# EAGLE board BusPirate-ultra.v1.0c (EAGLE 9.1.3), part 1 of 2
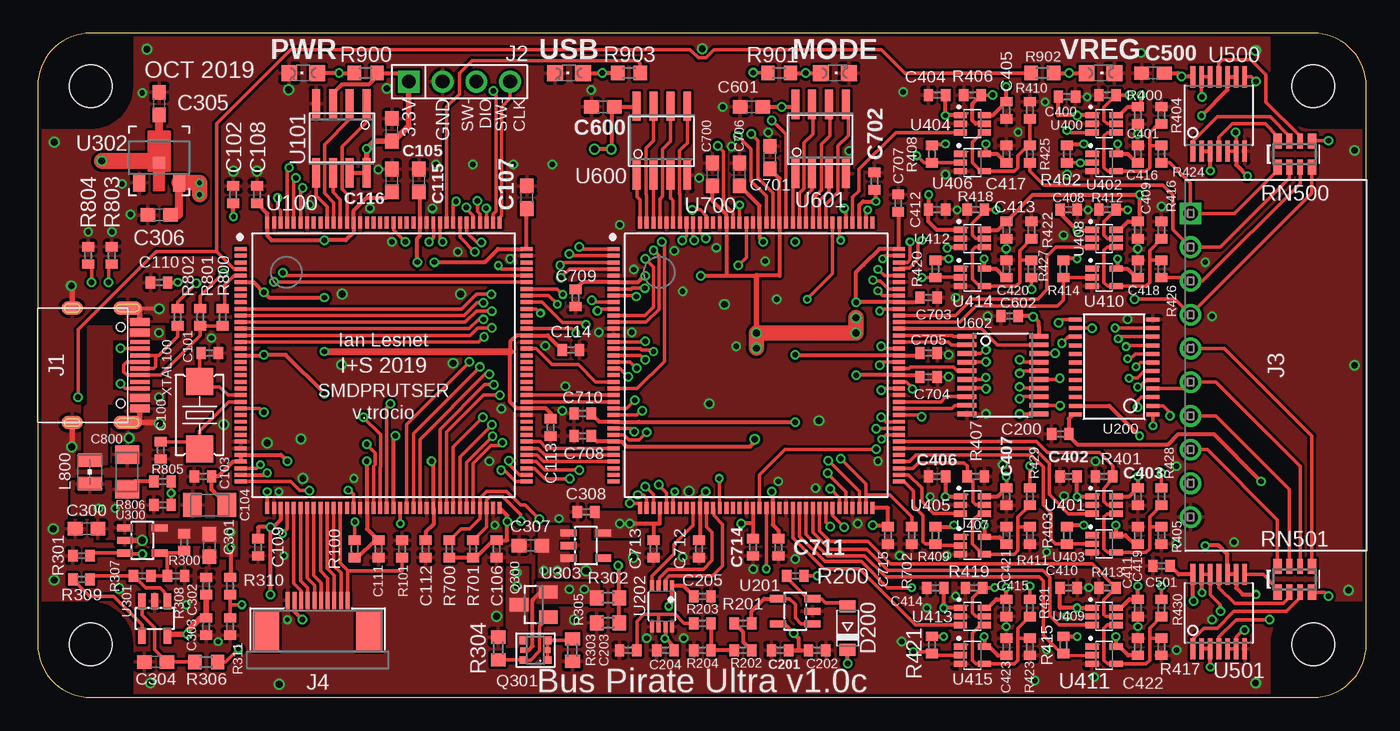
[diagram p3: board, top side]
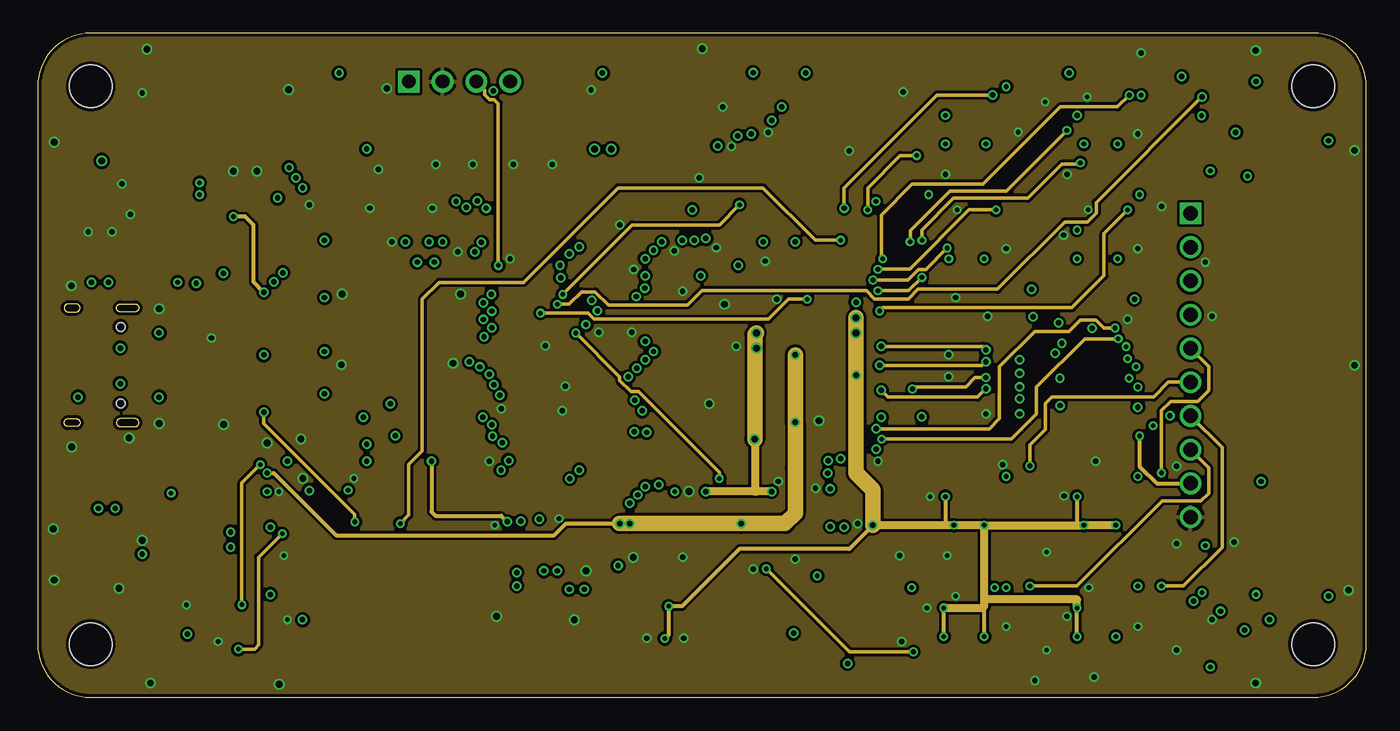
[diagram p4: board, inner layer Route2]
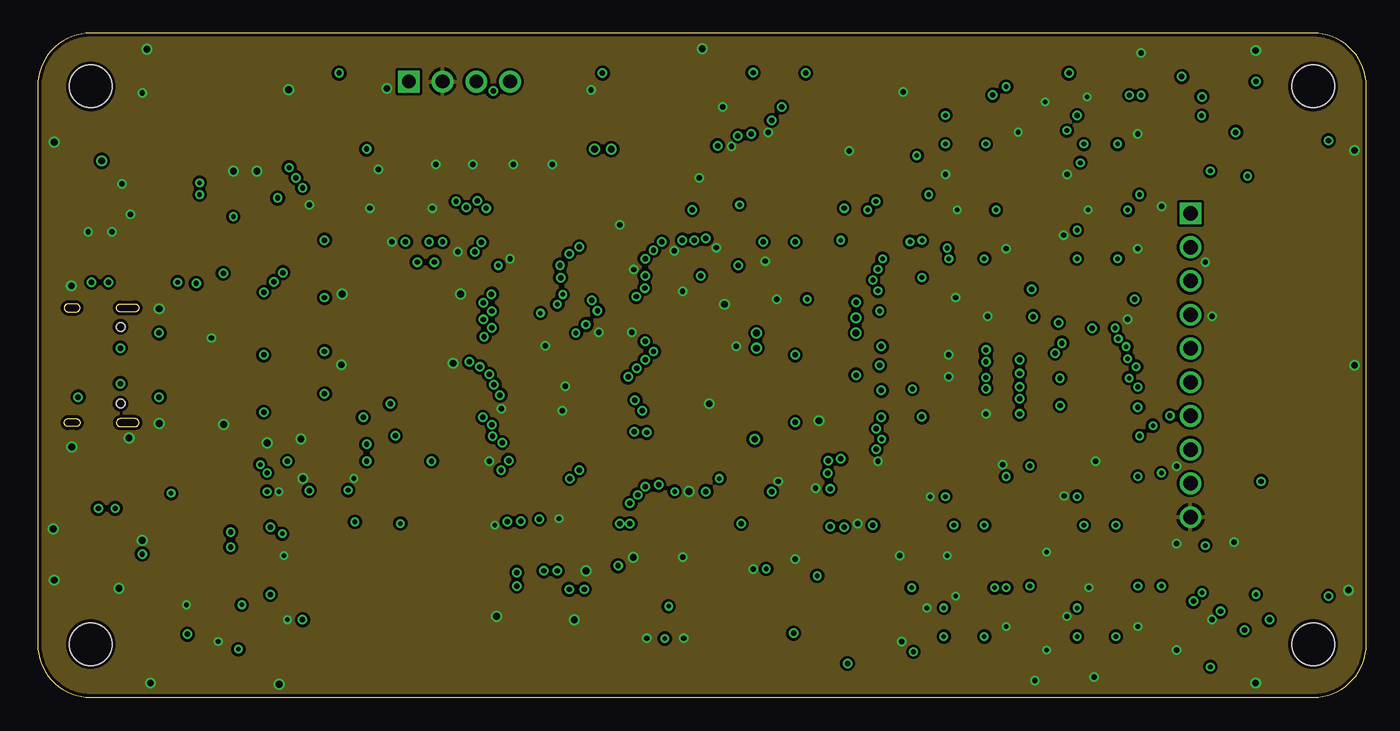
[diagram p5: board, inner layer Route15]
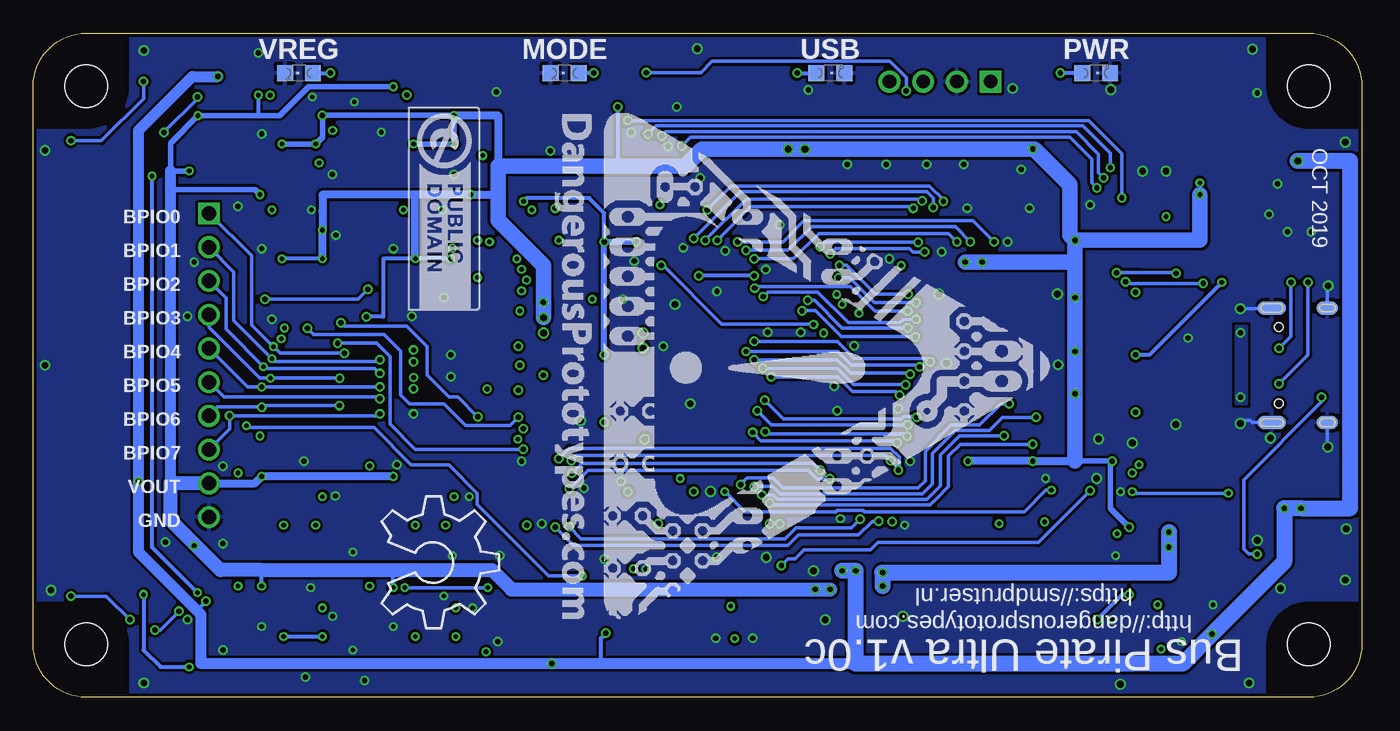
[diagram p6: board, bottom side, seen from below]

Size 100 x 50 mm. Coordinates in mm from the lower left corner, seen from the top.
Copper layers (1+2*15+16): Top 0.035mm / dielectric 1.5mm / Route2 0.0175mm / dielectric 1.1mm / Route15 0.0175mm / dielectric 0.2mm / Bottom 0.035mm
Design rules "dirt_cheap_dirty_boards.v1.1 *": minimum track width 6mil, minimum drill 12mil, track to track 6mil, track to pad 6mil, pad to pad 6mil, via to via 6mil, smd to smd 0mil, copper to edge 10mil, drill to drill 10mil, minimum pad ring 10mil, minimum via ring 6mil, stop-mask expansion 2mil, vias tented up to drill 25mil, thermal gap 10mil
Net classes: 1 power: width 0.305 mm; 2 signal_analog: width 0.254 mm; 3 signal_digital: width 0.254 mm; 4 signal_mixed: width 0.254 mm

## Footprints (pad centres in the part's own frame; a part is rotated, then mirrored left to right if it is on the bottom)
C402 = smd 0.7 x 0.9: 1 -0.65,0; 2 0.65,0
SMC_A = smd 1.4 x 1.8: + -1.3,0; - 1.3,0
C603 = smd 1.1 x 1: 1 -0.85,0; 2 0.85,0
SOD-123 = smd 0.91 x 1.22: A 1.635,0; C -1.635,0
C-31-M-12 = smd 0.3 x 1.45: CC1 -1.25,3.005; CC2 1.75,3.005; DN1 0.25,3.005; DN2 -0.75,3.005; DP1 -0.25,3.005; DP2 0.75,3.005; SBU1 1.25,3.005; SBU2 -1.75,3.005 | smd 0.6 x 1.45: GND@1 -3.25,3.005; GND@2 3.25,3.005; VBUS@1 -2.45,3.005; VBUS@2 2.45,3.005 | smd 1 x 2.1: P$1 4.32,2.09; P$2 -4.32,2.09 | smd 1 x 1.6: P$3 -4.32,-2.09; P$4 4.32,-2.09 | smd 1 x 2.1 bottom: P$5 -4.32,2.09; P$8 4.32,2.09 | smd 1 x 1.6 bottom: P$6 -4.32,-2.09; P$7 4.32,-2.09 | hole 0.65: 2.89,1.56; -2.89,1.56
M1X4 = drill 1.02 pad 1.632 square: 1 0,0 | drill 1.02 pad 1.632: 2 2.54,0; 3 5.08,0; 4 7.62,0
M1X10_MALE_RIGHT_ANGLES_PTH_SHROUDED = drill 1.09 square: 1 -11.43,-6.415 | drill 1.09: 2 -8.89,-6.415; 3 -6.35,-6.415; 4 -3.81,-6.415; 5 -1.27,-6.415; 6 1.27,-6.415; 7 3.81,-6.415; 8 6.35,-6.415; 9 8.89,-6.415; 10 11.43,-6.415
X05B20L10T = smd 0.3 x 1.3: 1 2.25,2.35; 2 1.75,2.35; 3 1.25,2.35; 4 0.75,2.35; 5 0.25,2.35; 6 -0.25,2.35; 7 -0.75,2.35; 8 -1.25,2.35; 9 -1.75,2.35; 10 -2.25,2.35 | smd 2 x 3: 11 -3.9,0; 12 3.9,0
WE-KI_0805_B = smd 1.02 x 1.78: 1 -0.89,0; 2 0.89,0
LED-805 = smd 1.2 x 1.2: A 0,-1.05; C 0,1.05
DP10050_V1 = hole 3.2: 4,4; 96,4; 96,46; 4,46
SOT-23 = smd 1 x 1.4: 1 -0.95,-1.1; 2 0.95,-1.1; 3 0,1.1
SOT-363 = smd 0.6 x 0.6: 1 -0.75,-0.9; 3 0.75,-0.9; 4 0.75,0.9; 6 -0.75,0.9 | smd 0.4 x 0.5: 2 0,-0.9; 5 0,0.9
R402 = smd 0.7 x 0.9: 1 -0.65,0; 2 0.65,0
R603 = smd 1 x 1.1: 1 -0.85,0; 2 0.85,0
RN8P-4R-CRA06S = smd 0.63 x 1.15: 1 -1.295,-0.975; 4 1.295,-0.975; 5 1.295,0.975; 8 -1.295,0.975 | smd 0.44 x 1.15: 2 -0.4,-0.975; 3 0.4,-0.975; 6 0.4,0.975; 7 -0.4,0.975
TQFP-144 = smd 0.9 x 0.3: 1 -10.75,8.75; 2 -10.75,8.25; 3 -10.75,7.75; 4 -10.75,7.25; 5 -10.75,6.75; 6 -10.75,6.25; 7 -10.75,5.75; 8 -10.75,5.25; 9 -10.75,4.75; 10 -10.75,4.25; 11 -10.75,3.75; 12 -10.75,3.25; 13 -10.75,2.75; 14 -10.75,2.25; 15 -10.75,1.75; 16 -10.75,1.25; 17 -10.75,0.75; 18 -10.75,0.25; 19 -10.75,-0.25; 20 -10.75,-0.75; 21 -10.75,-1.25; 22 -10.75,-1.75; 23 -10.75,-2.25; 24 -10.75,-2.75; 25 -10.75,-3.25; 26 -10.75,-3.75; 27 -10.75,-4.25; 28 -10.75,-4.75; 29 -10.75,-5.25; 30 -10.75,-5.75; 31 -10.75,-6.25; 32 -10.75,-6.75; 33 -10.75,-7.25; 34 -10.75,-7.75; 35 -10.75,-8.25; 36 -10.75,-8.75; 73 10.75,-8.75; 74 10.75,-8.25; 75 10.75,-7.75; 76 10.75,-7.25; 77 10.75,-6.75; 78 10.75,-6.25; 79 10.75,-5.75; 80 10.75,-5.25; 81 10.75,-4.75; 82 10.75,-4.25; 83 10.75,-3.75; 84 10.75,-3.25; 85 10.75,-2.75; 86 10.75,-2.25; 87 10.75,-1.75; 88 10.75,-1.25; 89 10.75,-0.75; 90 10.75,-0.25; 91 10.75,0.25; 92 10.75,0.75; 93 10.75,1.25; 94 10.75,1.75; 95 10.75,2.25; 96 10.75,2.75; 97 10.75,3.25; 98 10.75,3.75; 99 10.75,4.25; 100 10.75,4.75; 101 10.75,5.25; 102 10.75,5.75; 103 10.75,6.25; 104 10.75,6.75; 105 10.75,7.25; 106 10.75,7.75; 107 10.75,8.25; 108 10.75,8.75 | smd 0.3 x 0.9: 37 -8.75,-10.75; 38 -8.25,-10.75; 39 -7.75,-10.75; 40 -7.25,-10.75; 41 -6.75,-10.75; 42 -6.25,-10.75; 43 -5.75,-10.75; 44 -5.25,-10.75; 45 -4.75,-10.75; 46 -4.25,-10.75; 47 -3.75,-10.75; 48 -3.25,-10.75; 49 -2.75,-10.75; 50 -2.25,-10.75; 51 -1.75,-10.75; 52 -1.25,-10.75; 53 -0.75,-10.75; 54 -0.25,-10.75; 55 0.25,-10.75; 56 0.75,-10.75; 57 1.25,-10.75; 58 1.75,-10.75; 59 2.25,-10.75; 60 2.75,-10.75; 61 3.25,-10.75; 62 3.75,-10.75; 63 4.25,-10.75; 64 4.75,-10.75; 65 5.25,-10.75; 66 5.75,-10.75; 67 6.25,-10.75; 68 6.75,-10.75; 69 7.25,-10.75; 70 7.75,-10.75; 71 8.25,-10.75; 72 8.75,-10.75; 109 8.75,10.75; 110 8.25,10.75; 111 7.75,10.75; 112 7.25,10.75; 113 6.75,10.75; 114 6.25,10.75; 115 5.75,10.75; 116 5.25,10.75; 117 4.75,10.75; 118 4.25,10.75; 119 3.75,10.75; 120 3.25,10.75; 121 2.75,10.75; 122 2.25,10.75; 123 1.75,10.75; 124 1.25,10.75; 125 0.75,10.75; 126 0.25,10.75; 127 -0.25,10.75; 128 -0.75,10.75; 129 -1.25,10.75; 130 -1.75,10.75; 131 -2.25,10.75; 132 -2.75,10.75; 133 -3.25,10.75; 134 -3.75,10.75; 135 -4.25,10.75; 136 -4.75,10.75; 137 -5.25,10.75; 138 -5.75,10.75; 139 -6.25,10.75; 140 -6.75,10.75; 141 -7.25,10.75; 142 -7.75,10.75; 143 -8.25,10.75; 144 -8.75,10.75
SOIC-8 = smd 0.6 x 2.2: 1 -1.905,-2.6; 2 -0.635,-2.6; 3 0.635,-2.6; 4 1.905,-2.6; 5 1.905,2.6; 6 0.635,2.6; 7 -0.635,2.6; 8 -1.905,2.6
TSSOP-24 = smd 0.305 x 0.991: 1 -3.59,-2.918; 2 -2.94,-2.918; 3 -2.29,-2.918; 4 -1.64,-2.918; 5 -0.99,-2.918; 6 -0.34,-2.918; 7 0.31,-2.918; 8 0.96,-2.918; 9 1.61,-2.918; 10 2.26,-2.918; 11 2.91,-2.918; 12 3.56,-2.918; 13 3.56,2.918; 14 2.91,2.918; 15 2.26,2.918; 16 1.61,2.918; 17 0.96,2.918; 18 0.31,2.918; 19 -0.34,2.918; 20 -0.99,2.918; 21 -1.64,2.918; 22 -2.29,2.918; 23 -2.94,2.918; 24 -3.59,2.918
SOT-23-5 = smd 0.55 x 1.2: 1 -0.95,-1.3; 2 0,-1.3; 3 0.95,-1.3; 4 0.95,1.3; 5 -0.95,1.3
VSSOP-8_DCU_PDSO_G8 = smd 0.3 x 0.8: 1 -0.75,-1.55; 2 -0.25,-1.55; 3 0.25,-1.55; 4 0.75,-1.55; 5 0.75,1.55; 6 0.25,1.55; 7 -0.25,1.55; 8 -0.75,1.55
SOT-89 = smd 0.9 x 1.3: 1 -1.5,-1.65; 3 1.5,-1.65 | smd 0.9 x 0.9: 2 0,-0.15
SOT-23-5@1 = smd 0.55 x 1.2: 1 -0.95,-1.3; 2 0,-1.3; 3 0.95,-1.3; 4 0.95,1.3; 5 -0.95,1.3
SC-70-6 = smd 0.47 x 1: 1 -0.65,-0.9; 2 0,-0.9; 3 0.65,-0.9; 4 0.65,0.9; 5 0,0.9; 6 -0.65,0.9
SC-70-5 = smd 0.47 x 1: 1 -0.65,-0.9; 2 0,-0.9; 3 0.65,-0.9; 4 0.65,0.9; 5 -0.65,0.9
TSSOP-14 = smd 0.35 x 1.6: 1 -1.95,-2.7; 2 -1.3,-2.7; 3 -0.65,-2.7; 4 0,-2.7; 5 0.65,-2.7; 6 1.3,-2.7; 7 1.95,-2.7; 8 1.95,2.9; 9 1.3,2.9; 10 0.65,2.9; 11 0,2.9; 12 -0.65,2.9; 13 -1.3,2.9; 14 -1.95,2.9
TSSOP-20 = smd 0.35 x 1.43: 1 -2.925,-2.7; 2 -2.275,-2.7; 3 -1.625,-2.7; 4 -0.975,-2.7; 5 -0.325,-2.7; 6 0.325,-2.7; 7 0.975,-2.7; 8 1.625,-2.7; 9 2.275,-2.7; 10 2.925,-2.7; 11 2.925,2.7; 12 2.275,2.7; 13 1.625,2.7; 14 0.975,2.7; 15 0.325,2.7; 16 -0.325,2.7; 17 -0.975,2.7; 18 -1.625,2.7; 19 -2.275,2.7; 20 -2.925,2.7
XTAL_4X6 = smd 2.032 x 2.032: 1 -2.54,0; 2 2.54,0

## Placement (x,y rotation side)
C100  22pF  [C402]  9.27,18.59 270 top
C101  22pF  [C402]  12.95,25.91 0 top
C102  0.1uF  [C402]  14.73,37.85 90 top
C103  0.1uF  [C402]  12.45,16.64 180 top
C104  1uF  [SMC_A]  12.95,14.48 180 top
C105  0.1uF  [C603]  26.67,42.72 90 top
C106  0.1uF  [C402]  34.54,11.18 270 top
C107  0.1uF  [C603]  36.83,37.64 90 top
C108  0.1uF  [C402]  16.51,37.85 90 top
C109  0.1uF  [C402]  16.59,11.3 270 top
C110  0.1uF  [C402]  9.14,31.24 180 top
C111  0.1uF  [C402]  25.65,11.18 270 top
C112  0.1uF  [C402]  29.21,11.18 270 top
C113  0.1uF  [C402]  38.61,20.32 270 top
C114  0.1uF  [C402]  40.13,26.16 0 top
C115  0.1uF  [C603]  28.7,38.91 90 top
C116  0.1uF  [C603]  26.67,38.91 90 top
C200  0.1uF  [C402]  76.96,19.81 0 top
C201  0.1uF  [C402]  55.88,3.56 180 top
C202  1uF  [C402]  58.67,3.56 0 top
C203  1.5nF  [C402]  44.45,3.56 180 top
C204  1uF  [C402]  47.24,3.56 180 top
C205  1uF  [C402]  50.04,7.62 0 top
C300  4.7uF  [C603]  3.68,12.7 180 top
C301  4.7uF  [C603]  12.93,11.43 270 top
C302  1uF  [C402]  12.7,8.38 270 top
C303  0.1uF  [C402]  12.7,5.33 90 top
C304  DNP  [C603]  8.89,2.67 0 top
C305  4.7uF  [C603]  9.14,44.7 270 top
C306  1uF  [C603]  9.14,36.32 0 top
C307  4.7uF  [C603]  37.08,11.43 0 top
C308  1uF  [C402]  41.27,13.97 0 top
C400  0.1uF  [C402]  77.47,45.21 180 top
C401  0.1uF  [C402]  82.8,43.81 270 top
C402  0.1uF  [C402]  77.6,16.64 0 top
C403  0.1uF  [C402]  82.8,15.11 270 top
C404  0.1uF  [C402]  67.69,45.34 0 top
C405  0.1uF  [C402]  72.9,44.2 270 top
C406  0.1uF  [C402]  67.69,16.64 0 top
C407  0.1uF  [C402]  72.9,15.11 270 top
C408  0.1uF  [C402]  77.6,36.7 180 top
C409  0.1uF  [C402]  82.8,35.18 270 top
C410  0.1uF  [C402]  77.6,8.26 180 top
C411  0.1uF  [C402]  82.8,6.73 270 top
C412  0.1uF  [C402]  67.69,36.7 180 top
C413  0.1uF  [C402]  72.9,35.18 270 top
C414  0.1uF  [C402]  67.56,8.26 0 top
C415  0.1uF  [C402]  72.9,6.73 270 top
C416  0.1uF  [C402]  82.8,40.89 270 top
C417  0.1uF  [C402]  72.9,40.89 270 top
C418  0.1uF  [C402]  82.8,32.26 270 top
C419  0.1uF  [C402]  82.8,12.19 270 top
C420  0.1uF  [C402]  72.9,32.26 270 top
C421  0.1uF  [C402]  72.9,12.19 270 top
C422  0.1uF  [C402]  82.8,3.81 270 top
C423  0.1uF  [C402]  72.9,3.81 270 top
C500  0.1uF  [C603]  83.95,46.99 0 top
C501  0.1uF  [C402]  84.58,9.91 0 top
C600  0.1uF  [C603]  42.55,44.45 0 top
C601  0.1uF  [C603]  53.72,44.45 0 top
C602  0.1uF  [C402]  73.15,28.7 0 top
C700  0.1uF  [C603]  50.8,39.37 90 top
C701  0.1uF  [C603]  55.12,40.64 90 top
C702  0.1uF  [C402]  62.99,38.86 90 top
C703  0.1uF  [C402]  67.06,30.1 0 top
C704  0.1uF  [C402]  67.06,24.13 0 top
C705  0.1uF  [C402]  67.06,25.91 0 top
C706  0.1uF  [C603]  52.83,39.37 90 top
C707  0.1uF  [C402]  64.77,37.21 90 top
C708  0.1uF  [C402]  41.02,19.68 180 top
C709  0.1uF  [C402]  40.49,30.07 270 top
C710  0.1uF  [C402]  41.02,21.39 180 top
C711  0.1uF  [C402]  55.75,11.3 270 top
C712  0.1uF  [C402]  49.78,11.18 270 top
C713  0.1uF  [C402]  46.35,11.18 270 top
C714  0.1uF  [C402]  53.85,11.3 270 top
C715  0.1uF  [C402]  64.01,12.19 270 top
C800  10uF  [SMC_A]  6.73,16.97 90 top
D200  1N4148  [SOD-123]  60.96,5.21 90 top
J1  USB-C-12  [C-31-M-12]  4.69,25 270 top
J2  CON_HEADER_1X04  [M1X4]  27.94,46.35 0 top
J3  CON_HEADER_1X10-RIGHT_ANGLED_PTH_SHROUDED  [M1X10_MALE_RIGHT_ANGLES_PTH_SHROUDED]  93.19,25 270 top
J4  CON-FPC_X05B20L10T  [X05B20L10T]  21.08,4.95 0 top
L800  1.5A  [WE-KI_0805_B]  3.94,16.97 90 top
LED900  YELLOW  [LED-805]  20,47 90 top
LED901  YELLOW  [LED-805]  60,47 270 top
LED902  YELLOW  [LED-805]  80,47 270 top
LED903  YELLOW  [LED-805]  40,47 90 top
LED904  Optional YELLOW  [LED-805]  20,47 270 bottom
LED905  Optional YELLOW  [LED-805]  60,47 90 bottom
LED906  Optional YELLOW  [LED-805]  80,47 90 bottom
LED907  Optional YELLOW  [LED-805]  40,47 270 bottom
LOGO1  LOGO_CC-0  [LOGO_CC-0]  71.75,44.45 270 bottom
PCB1  PCB_DP_RECTANGLE-50X100  [DP10050_V1]  0,0 0 top
Q300  PMV65XP  [SOT-23]  37.34,6.99 90 top
Q301  DMMT3906W  [SOT-363]  37.47,3.56 90 top
R100  10K  [R402]  23.88,11.18 270 top
R101  10K  [R402]  27.43,11.18 270 top
R200  0R  [R402]  57.02,9.14 180 top
R201  0R  [R402]  53.09,5.59 180 top
R202  10K  [R402]  53.09,3.56 180 top
R203  25R  [R402]  50.04,5.59 180 top
R204  10K  [R402]  50.04,3.56 180 top
R300  99.22K  [R402]  11.05,11.68 90 top
R301  100K  [R402]  3.3,10.67 180 top
R302  10K  [R603]  42.93,7.49 0 top
R303  65K  [R603]  40.26,3.56 90 top
R304  100K  [R603]  34.67,3.68 270 top
R305  10K  [R603]  42.93,5.61 180 top
R306  0R  [R603]  12.7,2.67 180 top
R307  77.96K  [R402]  7.87,9.14 0 top
R308  10K  [R402]  10.41,9.14 0 top
R309  0R  [R402]  3.3,8.89 0 top
R310  10K  [R402]  14.48,8.38 270 top
R311  10K  [R402]  14.48,5.33 270 top
R400  100K  [R402]  80.52,45.34 0 top
R401  100K  [R402]  80.26,16.64 0 top
R402  100K  [R402]  77.47,40.89 90 top
R403  100K  [R402]  77.47,12.19 90 top
R404  1M  [R402]  84.58,43.81 270 top
R405  1M  [R402]  84.58,12.19 90 top
R406  100K  [R402]  70.36,45.34 0 top
R407  100K  [R402]  70.61,16.64 180 top
R408  100K  [R402]  67.31,40.89 90 top
R409  100K  [R402]  67.56,12.19 90 top
R410  1M  [R402]  74.68,44.2 270 top
R411  1M  [R402]  74.68,12.19 90 top
R412  100K  [R402]  80.52,36.7 0 top
R413  100K  [R402]  80.52,8.26 0 top
R414  100K  [R402]  77.22,32.26 90 top
R415  100K  [R402]  77.22,3.94 90 top
R416  1M  [R402]  84.58,35.18 270 top
R417  1M  [R402]  84.58,3.81 90 top
R418  100K  [R402]  70.61,36.7 0 top
R419  100K  [R402]  70.48,8.26 0 top
R420  100K  [R402]  67.56,32.26 90 top
R421  100K  [R402]  67.31,3.94 90 top
R422  1M  [R402]  74.8,35.18 270 top
R423  1M  [R402]  74.68,3.81 90 top
R424  220R  [R402]  84.58,40.89 90 top
R425  220R  [R402]  74.68,40.89 90 top
R426  220R  [R402]  84.58,32.26 90 top
R427  220R  [R402]  74.8,32.26 90 top
R428  220R  [R402]  84.58,15.11 270 top
R429  220R  [R402]  74.68,15.11 270 top
R430  220R  [R402]  84.58,6.73 270 top
R431  220R  [R402]  74.68,6.73 270 top
R700  10K  [R402]  30.99,11.18 270 top
R701  10K  [R402]  32.77,11.18 270 top
R702  10K  [R402]  65.79,12.19 90 top
R800  1.5K  [R402]  13.94,28.62 90 top
R801  22R  [R402]  12.24,28.62 270 top
R802  22R  [R402]  10.54,28.62 270 top
R803  5K1  [R402]  5.59,33.27 90 top
R804  5K1  [R402]  3.81,33.27 90 top
R805  50K  [R402]  9.4,16.26 0 top
R806  50K  [R402]  9.4,14.48 0 top
R900  1K1  [R603]  24.7,47 0 top
R901  1K1  [R603]  55.81,47 180 top
R902  1K1  [R603]  75.62,47 180 top
R903  1K1  [R603]  44.51,47 0 top
RN500  2K  [RN8P-4R-CRA06S]  94.61,40.89 0 top
RN501  2K  [RN8P-4R-CRA06S]  94.61,8.89 0 top
U100  STM32F103ZX  [TQFP-144]  26.04,25 0 top
U101  W25X40CL  [SOIC-8]  22.86,42.09 180 top
U200  74HCT4067  [TSSOP-24]  81.03,24.89 90 top
U201  MCP6001  [SOT-23-5]  57.02,6.48 90 top
U202  ADS7041  [VSSOP-8_DCU_PDSO_G8]  46.99,6.86 180 top
U300  MCP1824_ADJ  [SOT-23-5]  7.87,11.81 270 top
U301  MCP6001  [SOT-23-5]  8.81,5.94 180 top
U302  MCP1700  [SOT-89]  9.14,40.39 0 top
U303  MCP1801T-1202I/OT  [SOT-23-5@1]  41.27,11.43 270 top
U400  SN74LVC1T45DBV  [SC-70-6]  80.26,43.18 270 top
U401  SN74LVC1T45DBV  [SC-70-6]  80.26,14.48 270 top
U402  74LVC1G07DBV  [SC-70-5]  80.26,40.26 270 top
U403  74LVC1G07DBV  [SC-70-5]  80.26,11.56 270 top
U404  SN74LVC1T45DBV  [SC-70-6]  70.36,43.18 270 top
U405  SN74LVC1T45DBV  [SC-70-6]  70.36,14.48 270 top
U406  74LVC1G07DBV  [SC-70-5]  70.36,40.26 270 top
U407  74LVC1G07DBV  [SC-70-5]  70.36,11.43 270 top
U408  SN74LVC1T45DBV  [SC-70-6]  80.26,34.54 270 top
U409  SN74LVC1T45DBV  [SC-70-6]  80.26,6.1 270 top
U410  74LVC1G07DBV  [SC-70-5]  80.26,31.62 270 top
U411  74LVC1G07DBV  [SC-70-5]  80.26,3.17 270 top
U412  SN74LVC1T45DBV  [SC-70-6]  70.36,34.54 270 top
U413  SN74LVC1T45DBV  [SC-70-6]  70.36,6.1 270 top
U414  74LVC1G07DBV  [SC-70-5]  70.36,31.62 270 top
U415  74LVC1G07DBV  [SC-70-5]  70.36,3.17 270 top
U500  74HCT4066PW  [TSSOP-14]  88.9,43.81 0 top
U501  74HCT4066PW  [TSSOP-14]  88.9,6.35 0 top
U600  23LC1024  [SOIC-8]  46.99,41.91 0 top
U601  23LC1024  [SOIC-8]  58.93,42.04 0 top
U602  74LVC245A  [TSSOP-20]  72.64,24.26 270 top
U700  ICE40HX4K  [TQFP-144]  54.09,25 0 top
U$1  [DP-LOGO]  61.84,-11.22 0 top  (outside the outline)
U$2  [OSHW_8X350_NOTEXT]  73.79,15.11 270 bottom
U$4  [DP_LOGO_ART_1.5X1.5]  60.72,43.98 270 bottom
XTAL100  8Mhz  [XTAL_4X6]  12.19,21.26 90 top